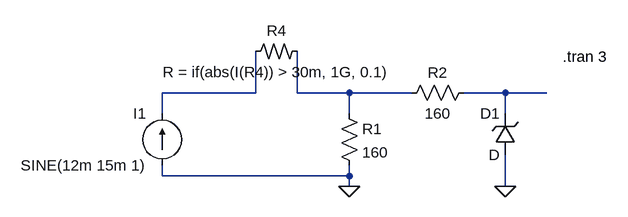
[diagram p0: schematic SDADC.asc]
SDADC.asc, the LTspice schematic file:
Version 4.1
SHEET 1 880 680
WIRE 128 160 128 96
WIRE 128 160 -16 160
WIRE 192 160 192 96
WIRE 272 160 192 160
WIRE 368 160 272 160
WIRE 512 160 448 160
WIRE 576 160 512 160
WIRE -16 192 -16 160
WIRE 272 192 272 160
WIRE 512 192 512 160
WIRE -16 288 -16 272
WIRE 272 288 272 272
WIRE 272 288 -16 288
WIRE 272 304 272 288
WIRE 512 304 512 256
FLAG 272 304 0
FLAG 512 304 0
SYMBOL res 256 176 R0
SYMATTR InstName R1
SYMATTR Value 160
SYMBOL res 464 144 R90
WINDOW 0 0 56 VBottom 2
WINDOW 3 32 56 VTop 2
SYMATTR InstName R2
SYMATTR Value 160
SYMBOL zener 528 256 R180
WINDOW 0 24 64 Left 2
WINDOW 3 24 0 Left 2
SYMATTR InstName D1
SYMBOL current -16 272 R180
WINDOW 0 24 80 Left 2
WINDOW 3 24 0 Left 2
WINDOW 123 0 0 Left 0
WINDOW 39 0 0 Left 0
SYMATTR InstName I1
SYMATTR Value SINE(12m 15m 1)
SYMBOL res2 128 112 R270
WINDOW 0 32 32 VTop 2
WINDOW 3 0 32 VBottom 2
SYMATTR InstName R4
SYMATTR Value R = if(abs(I(R4)) > 30m, 1G, 0.1)
TEXT 600 104 Left 2 !.tran 3

The netlist it stands for:
* SDADC.asc
R1 N002 0 160
R2 N003 N002 160
D1 0 N003 D
I1 0 N001 SINE(12m 15m 1)
R4 N001 N002 R = if(abs(I(R4)) > 30m, 1G, 0.1)
.model D D
.lib standard.dio
.tran 3
.backanno
.end